# EAGLE board EEZ Arduino shield+BP r1B12b (EAGLE 6.1), part 1 of 2
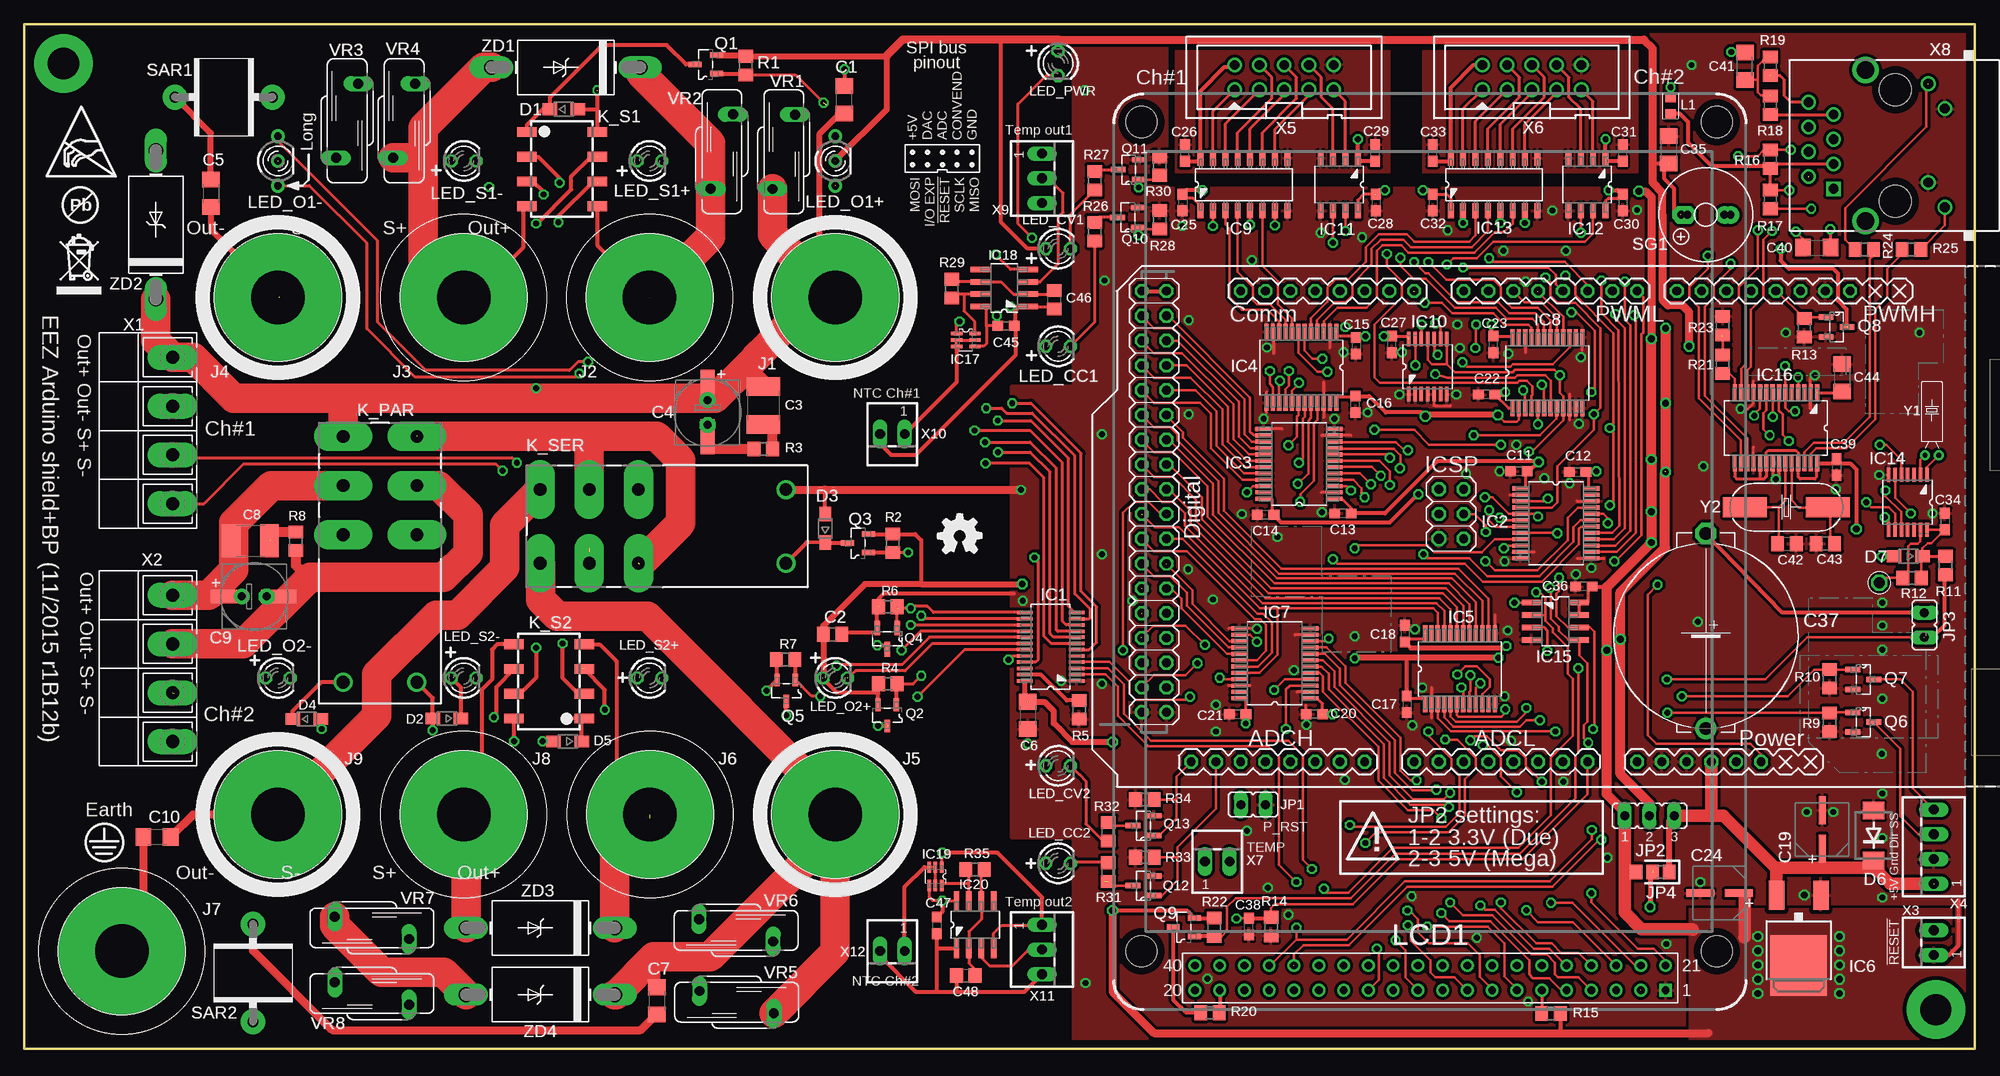
[diagram p5: board, top side]
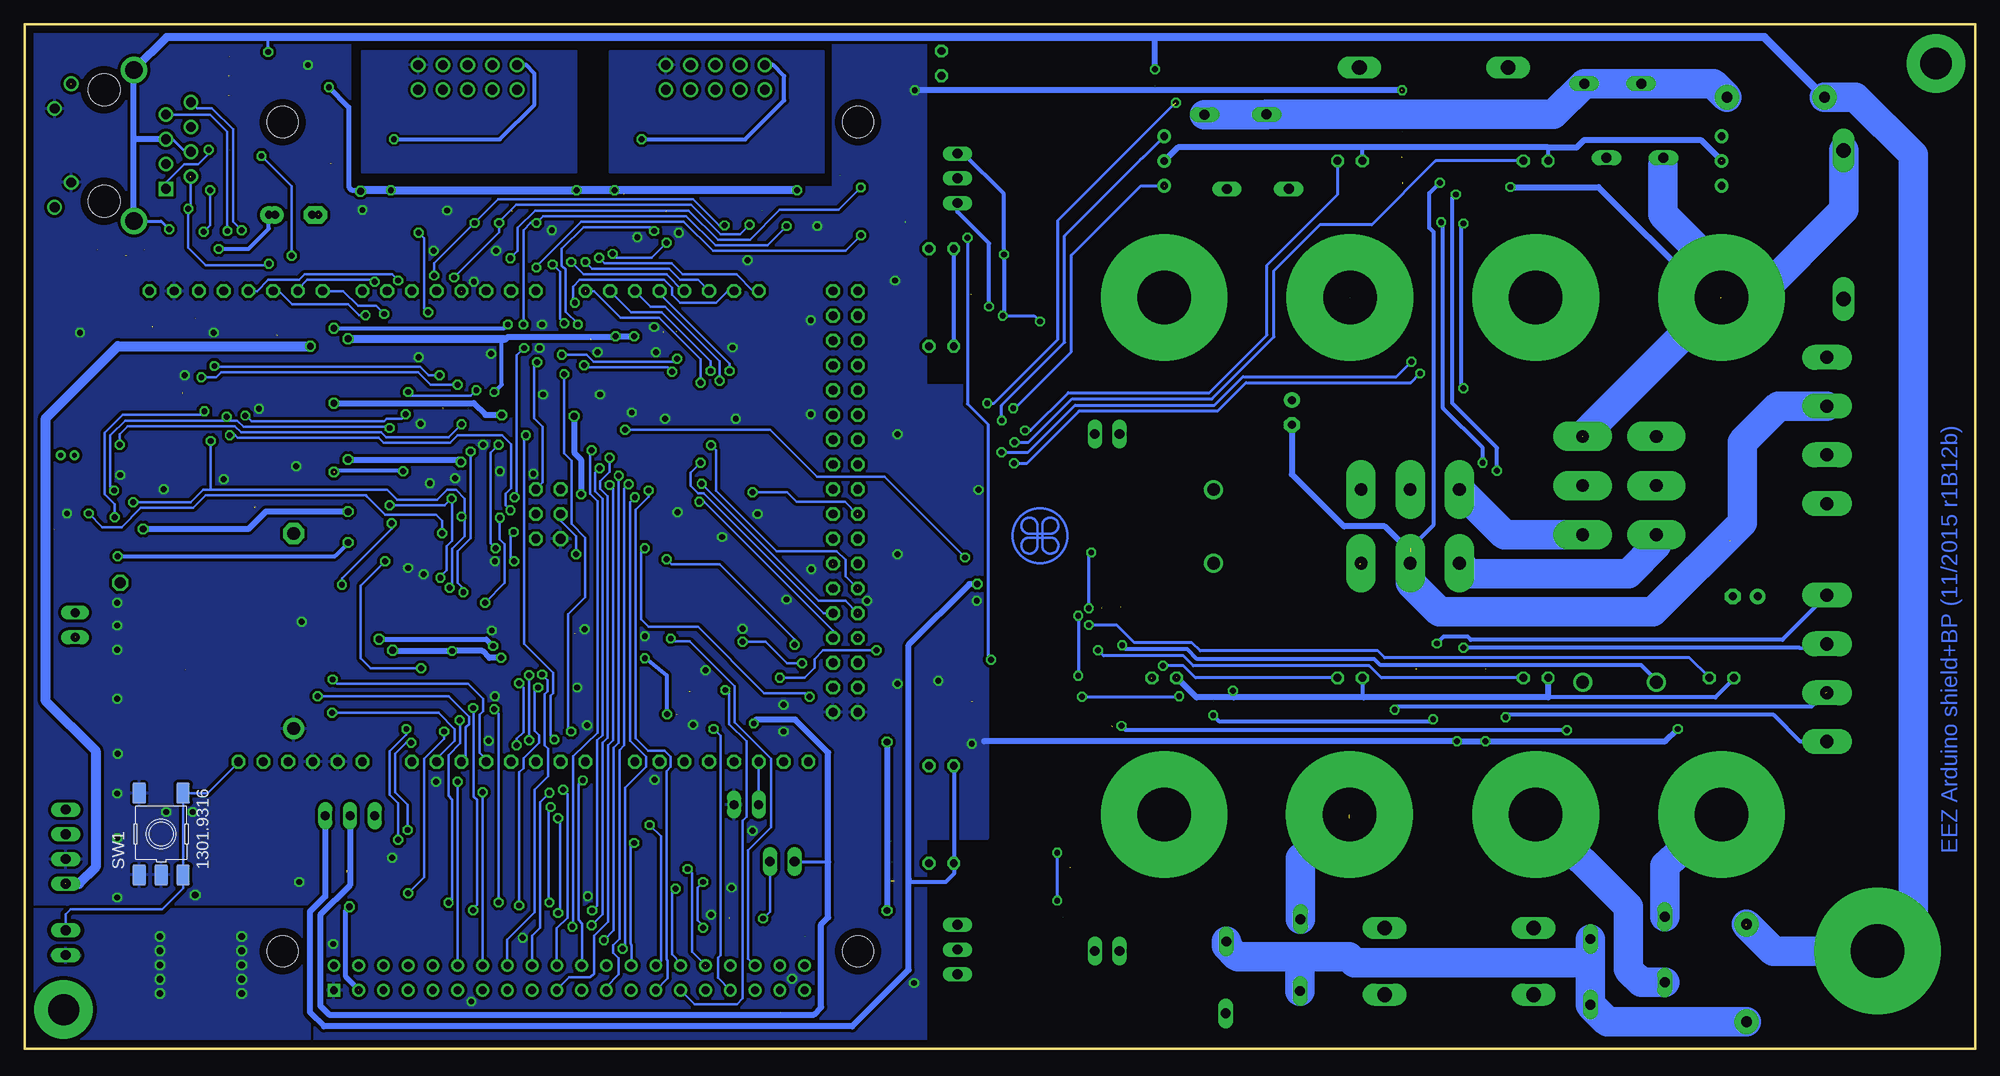
[diagram p6: board, bottom side, seen from below]

Size 200.03 x 105 mm. Coordinates in mm from the lower left corner, seen from the top.
Outline: 0,0 0,105 200,105 200,0 0,0
Copper layers (1+5*16): Top 0.035mm / dielectric 0.75mm / Route5 0.035mm / dielectric 0.75mm / Bottom 0.035mm
Design rules: minimum track width 10mil, minimum drill 0.5mm, track to track 8mil, track to pad 8mil, pad to pad 8mil, via to via 8mil, smd to smd 8mil, copper to edge 30mil, drill to drill 8mil, minimum pad ring 10mil, minimum via ring 8mil, stop-mask expansion 0mil, vias tented up to drill 25mil, thermal gap 10mil
Net classes: 0 default: width 0.254 mm, drill 0.61 mm, clearance 0.254 mm; 1 power: width 0.254 mm, drill 0.406 mm, clearance 0.203 mm; 2 gnd: width 0.254 mm, drill 0.406 mm, clearance 0.203 mm; 3 isolators: width 0.254 mm, drill 0.61 mm, clearance 0.254 mm

## Footprints (pad centres in the part's own frame; a part is rotated, then mirrored left to right if it is on the bottom)
C1206 = smd 1.6 x 1.8: 1 -1.4,0; 2 1.4,0
C0805 = smd 1.3 x 1.5: 1 -0.95,0; 2 0.95,0
C1812 = smd 1.9 x 3.4: 1 -1.95,0; 2 1.95,0
CAPAE660X610N_COMBO2 = smd 3.6 x 1.4: 1 -2.6,0; 2 2.5,0 | drill 0.813 pad 1.6: 1.1 -1.27,0 | drill 0.813 pad 1.6 octagon: 2.1 1.27,0
C0603 = smd 1.1 x 1: 1 -0.85,0; 2 0.85,0
PANASONIC_C = smd 2.87 x 0.762: 1 -1.981,0; 2 1.981,0
SG-R20MM = drill 1.3 pad 2.184 octagon: 1 10.389,0 | drill 1.3 pad 2.184: 2 -9.601,0
SOD323-W = smd 1.5 x 1.2: A 1.45,0; C -1.45,0
DO214AA = smd 1.8 x 2.2: A 2.55,0; C -2.55,0
SOP63P600X175-24N = smd 1.6 x 0.356: 1 -2.667,3.505; 2 -2.667,2.845; 3 -2.667,2.235; 4 -2.667,1.575; 5 -2.667,0.965; 6 -2.667,0.305; 7 -2.667,-0.305; 8 -2.667,-0.965; 9 -2.667,-1.575; 10 -2.667,-2.235; 11 -2.667,-2.845; 12 -2.667,-3.505; 13 2.667,-3.505; 14 2.667,-2.845; 15 2.667,-2.235; 16 2.667,-1.575; 17 2.667,-0.965; 18 2.667,-0.305; 19 2.667,0.305; 20 2.667,0.965; 21 2.667,1.575; 22 2.667,2.235; 23 2.667,2.845; 24 2.667,3.505
SOP65P780X200-24N = smd 1.651 x 0.432: 1 -3.632,3.581; 2 -3.632,2.921; 3 -3.632,2.286; 4 -3.632,1.626; 5 -3.632,0.965; 6 -3.632,0.33; 7 -3.632,-0.33; 8 -3.632,-0.965; 9 -3.632,-1.626; 10 -3.632,-2.286; 11 -3.632,-2.921; 12 -3.632,-3.581; 13 3.632,-3.581; 14 3.632,-2.921; 15 3.632,-2.286; 16 3.632,-1.626; 17 3.632,-0.965; 18 3.632,-0.33; 19 3.632,0.33; 20 3.632,0.965; 21 3.632,1.626; 22 3.632,2.286; 23 3.632,2.921; 24 3.632,3.581
DPACK = smd 1.6 x 3: 1 -2.28,-4.8; 3 2.28,-4.8 | smd 5.8 x 6.2: 4 0,2.38
SOIC-16 = smd 1.549 x 0.61: 1 -2.692,4.445; 2 -2.692,3.175; 3 -2.692,1.905; 4 -2.692,0.635; 5 -2.692,-0.635; 6 -2.692,-1.905; 7 -2.692,-3.175; 8 -2.692,-4.445; 9 2.692,-4.445; 10 2.692,-3.175; 11 2.692,-1.905; 12 2.692,-0.635; 13 2.692,0.635; 14 2.692,1.905; 15 2.692,3.175; 16 2.692,4.445
SOP65P640X120-14N = smd 1.473 x 0.356: 1 -2.819,1.956; 2 -2.819,1.295; 3 -2.819,0.66; 4 -2.819,0; 5 -2.819,-0.66; 6 -2.819,-1.295; 7 -2.819,-1.956; 8 2.819,-1.956; 9 2.819,-1.295; 10 2.819,-0.66; 11 2.819,0; 12 2.819,0.66; 13 2.819,1.295; 14 2.819,1.956
SOIC127P600X173-8N = smd 1.55 x 0.6: 1 -2.7,1.9; 2 -2.7,0.63; 3 -2.7,-0.64; 4 -2.7,-1.91; 5 2.7,-1.91; 6 2.7,-0.64; 7 2.7,0.63; 8 2.7,1.9
SOIC127P600X175-8N = smd 1.981 x 0.559: 1 -2.464,1.905; 2 -2.464,0.635; 3 -2.464,-0.635; 4 -2.464,-1.905; 5 2.464,-1.905; 6 2.464,-0.635; 7 2.464,0.635; 8 2.464,1.905
SOP65P780X200-28N = smd 1.651 x 0.432: 1 -3.632,4.216; 2 -3.632,3.581; 3 -3.632,2.921; 4 -3.632,2.286; 5 -3.632,1.626; 6 -3.632,0.965; 7 -3.632,0.33; 8 -3.632,-0.33; 9 -3.632,-0.965; 10 -3.632,-1.626; 11 -3.632,-2.286; 12 -3.632,-2.921; 13 -3.632,-3.581; 14 -3.632,-4.216; 15 3.632,-4.216; 16 3.632,-3.581; 17 3.632,-2.921; 18 3.632,-2.286; 19 3.632,-1.626; 20 3.632,-0.965; 21 3.632,-0.33; 22 3.632,0.33; 23 3.632,0.965; 24 3.632,1.626; 25 3.632,2.286; 26 3.632,2.921; 27 3.632,3.581; 28 3.632,4.216
SOT65P210X110-6N = smd 1.168 x 0.356: 1 -0.94,0.66; 2 -0.94,0; 3 -0.94,-0.66; 4 0.94,-0.66; 5 0.94,0; 6 0.94,0.66
BP_5_12/15WHITE = drill 5.5 pad 13: P$1 0,0
BP_5_12/15BLK = drill 5.5 pad 13: P$1 0,0
JP1 = drill 0.914 long: 1 0,-1.27; 2 0,1.27
JUMPER_3-PIN = drill 0.914 long: 1 -2.54,0; 2 0,0; 3 2.54,0
A0R-JMP = smd 1.5 x 1.3: 1 0,1.7; 2 0,0; 3 0,-1.7
RT-C/016A5 = drill 1.3 pad 3 long: 11A 8.83,3.78; 11B 8.83,-3.78; 12A 3.79,3.78; 12B 3.79,-3.78; 14A 13.87,3.78; 14B 13.87,-3.78 | drill 1.3: A1 -11.33,-3.78; A2 -11.33,3.78
G6K-2F = smd 1 x 2: 1 -3.81,-3.6; 2 -1.27,-3.6; 3 1.27,-3.6; 4 3.81,-3.6; 5 3.81,3.6; 6 1.27,3.6; 7 -1.27,3.6; 8 -3.81,3.6
BEAD0603 = smd 1 x 1.1: P$1 -0.85,0; P$2 0.85,0
LCD_TFT_320QVT_MIRROR = drill 0.8 square: 1 48.26,0 | drill 0.8: 2 45.72,0; 3 43.18,0; 4 40.64,0; 5 38.1,0; 6 35.56,0; 7 33.02,0; 8 30.48,0; 9 27.94,0; 10 25.4,0; 11 22.86,0; 12 20.32,0; 13 17.78,0; 14 15.24,0; 15 12.7,0; 16 10.16,0; 17 7.62,0; 18 5.08,0; 19 2.54,0; 20 0,0; 21 48.26,2.54; 22 45.72,2.54; 23 43.18,2.54; 24 40.64,2.54; 25 38.1,2.54; 26 35.56,2.54; 27 33.02,2.54; 28 30.48,2.54; 29 27.94,2.54; 30 25.4,2.54; 31 22.86,2.54; 32 20.32,2.54; 33 17.78,2.54; 34 15.24,2.54; 35 12.7,2.54; 36 10.16,2.54; 37 7.62,2.54; 38 5.08,2.54; 39 2.54,2.54; 40 0,2.54 | hole 3.2: -5.5,4; 53.5,4; -5.5,89; 53.5,89
LED3MM = drill 0.813 octagon: A -1.27,0; K 1.27,0
DUO_LED3MM = drill 0.8 pad 1.4: A 2.54,0; AG -2.54,0; C 0,0
ARDUINO+ICSP_MIRROR = drill 0.9 octagon: 0 63.5,2.54; 1 60.96,2.54; 2 58.42,2.54; 3 55.88,2.54; 3.3V 35.56,50.8; 4 53.34,2.54; 5 50.8,2.54; 5V 38.1,50.8; 5V(1) 93.98,2.54; 5V(2) 96.52,2.54; 6 48.26,2.54; 7 45.72,2.54; 8 41.656,2.54; 9 39.116,2.54; 10 36.576,2.54; 11 34.036,2.54; 12 31.496,2.54; 13 28.956,2.54; 14 68.58,2.54; 15 71.12,2.54; 16 73.66,2.54; 17 76.2,2.54; 18 78.74,2.54; 19 81.28,2.54; 20 83.82,2.54; 21 86.36,2.54; 22 93.98,5.08; 23 96.52,5.08; 24 93.98,7.62; 25 96.52,7.62; 26 93.98,10.16; 27 96.52,10.16; 28 93.98,12.7; 29 96.52,12.7; 30 93.98,15.24; 31 96.52,15.24; 32 93.98,17.78; 33 96.52,17.78; 34 93.98,20.32; 35 96.52,20.32; 36 93.98,22.86; 37 96.52,22.86; 38 93.98,25.4; 39 96.52,25.4; 40 93.98,27.94; 41 96.52,27.94; 42 93.98,30.48; 43 96.52,30.48; 44 93.98,33.02; 45 96.52,33.02; 46 93.98,35.56; 47 96.52,35.56; 48 93.98,38.1; 49 96.52,38.1; 50 93.98,40.64; 51 96.52,40.64; 52 93.98,43.18; 53 96.52,43.18; A0 50.8,50.8; A1 53.34,50.8; A2 55.88,50.8; A3 58.42,50.8; A4 60.96,50.8; A5 63.5,50.8; A6 66.04,50.8; A7 68.58,50.8; A8 73.66,50.8; A9 76.2,50.8; A10 78.74,50.8; A11 81.28,50.8; A12 83.82,50.8; A13 86.36,50.8; A14 88.9,50.8; A15 91.44,50.8; AREF 23.876,2.54; GND 26.416,2.54; GND1 40.64,50.8; GND2 43.18,50.8; GND3 93.98,45.72; GND4 96.52,45.72; ICSP_+5V 66.04,22.86; ICSP_MISO 63.5,22.86; ICSP_MOSI 66.04,25.4; ICSP_RESET 63.5,27.94; ICSP_SCK 63.5,25.4; RESET 33.02,50.8; VIN 45.72,50.8 | drill 1.016 octagon: ICSP_GND 66.04,27.94
SOT95P237X112-3N = smd 1.321 x 0.559: 1 -1.092,0.94; 2 -1.092,-0.94; 3 1.092,0
SOT103P240X110-3N = smd 1.524 x 0.559: 1 -1.079,1.016; 2 -1.079,-1.016; 3 1.079,0
R0805 = smd 1.3 x 1.5: 1 -0.95,0; 2 0.95,0
SAR = drill 1.1 pad 2.54: P$1 0,0; P$2 10,0
BUZZER = drill 0.8 pad 1.778 octagon: + 1.905,0; +B 2.54,0 | drill 0.8 pad 1.778: - -1.905,0; -B -2.54,0
TACTM-6XN = smd 2.1 x 1.4: 1 -4.2,2.25; 2 4.2,2.25; 3 -4.2,-2.25; 4 4.2,-2.25; 5 -4.2,0
PCB_SHIELD_TAB = drill 1.1 octagon: 1 0,0
S10K175 = drill 1.016 long: 1 -1.143,-3.81; 2 1.143,3.81
TBLOCK5.0_4S = drill 1.35 pad 2.54 long: P$1 0,0; P$2 0,-5; P$3 0,-10; P$4 0,-15
22-23-2021 = drill 1 long: 1 -1.27,0; 2 1.27,0
22-23-2041 = drill 1 long: 1 -3.81,0; 2 -1.27,0; 3 1.27,0; 4 3.81,0
IDC-10PIN = drill 1 pad 1.422: 1 -5.08,-1.27; 2 -5.08,1.27; 3 -2.54,-1.27; 4 -2.54,1.27; 5 0,-1.27; 6 0,1.27; 7 2.54,-1.27; 8 2.54,1.27; 9 5.08,-1.27; 10 5.08,1.27
RJ45-TRAFO-LED = drill 1 square: 1 -4.445,6.35 | drill 1: 2 -3.175,8.89; 3 -1.905,6.35; 4 -0.635,8.89; 5 0.635,6.35; 6 1.905,8.89; 7 3.175,6.35; 8 4.445,8.89; 9 -6.325,-5.08; 10 -3.785,-3.38; 11 3.785,-5.08; 12 6.325,-3.38 | drill 1.8: SH1 -7.75,3.05; SH2 7.75,3.05 | hole 3.251: -5.715,0; 5.715,0
22-23-2031 = drill 1 long: 1 -2.54,0; 2 0,0; 3 2.54,0
R26_XTAL = drill 0.5: 1 -0.7,0; 2 0.7,0
HC-49/4H = smd 4.5 x 2: 1 -4.25,0; 2 4.25,0
DO201 = drill 1.499 long: A 7.62,0; C -7.62,0

## Placement (x,y rotation side)
C1  10n  [C1206]  84.08,97.28 90 top
C2  1u  [C0805]  82.88,42.48 0 top
C3  470n/100V  [C1812]  75.77,65.91 270 top
C4  22u/63V  [CAPAE660X610N_COMBO2]  70.06,65.21 270 top
C5  10n  [C1206]  19.13,87.69 270 top
C6  10u  [C1206]  102.89,34.16 270 top
C7  10n  [C1206]  64.85,4.89 270 top
C8  470n/100V  [C1812]  23.19,52.07 0 top
C9  22u/63V  [CAPAE660X610N_COMBO2]  23.57,46.35 0 top
C10  10n  [C1206]  13.61,21.72 0 top
C11  100n  [C0603]  153.24,59.18 180 top
C12  100n  [C0603]  159.27,59.12 0 top
C13  100n  [C0603]  135.21,54.86 180 top
C14  100n  [C0603]  127.27,54.74 0 top
C15  100n  [C0603]  136.54,72.06 270 top
C16  100n  [C0603]  136.48,66.05 90 top
C17  100n  [C0603]  141.75,35.31 270 top
C18  100n  [C0603]  141.56,42.55 270 top
C19  47u  [PANASONIC_C]  184.36,22.48 90 top
C20  100n  [C0603]  132.29,34.29 180 top
C21  100n  [C0603]  124.41,34.29 0 top
C22  100n  [C0603]  149.94,67.06 180 top
C23  100n  [C0603]  150.64,72.2 90 top
C24  10u  [PANASONIC_C]  173.82,15.94 180 top
C25  100n  [C0603]  118.76,86.74 270 top
C26  100n  [C0603]  119.02,91.82 90 top
C27  100n  [C0603]  140.22,72.2 90 top
C28  100n  [C0603]  138.57,86.74 270 top
C29  100n  [C0603]  138.51,91.82 90 top
C30  100n  [C0603]  163.91,86.74 270 top
C31  100n  [C0603]  163.91,91.82 90 top
C32  100n  [C0603]  144.41,86.74 270 top
C33  100n  [C0603]  144.41,91.82 90 top
C34  100n  [C0603]  196.93,54.04 270 top
C35  10u  [C1206]  168.61,92.14 270 top
C36  100n  [C0603]  159.91,47.37 180 top
C37  EECS5R5H105  [SG-R20MM]  172.42,42.42 90 top
C38  100n  [C0603]  125.56,12.51 90 top
C39  100n  [C0603]  185.82,59.63 270 top
C40  10n  [C1206]  183.78,82.11 0 top
C41  10n  [C1206]  176.42,100.71 90 top
C42  18p  [C0805]  180.74,51.75 0 top
C43  18p  [C0805]  184.67,51.75 180 top
C44  10u  [C1206]  186.39,68.77 270 top
C45  100n  [C0603]  100.66,74.1 0 top
C46  47n  [C0805]  105.62,76.77 90 top
C47  100n  [C0603]  93.55,12.64 270 top
C48  47n  [C0805]  96.54,7.49 0 top
D1  BAS316  [SOD323-W]  55.32,96.3 0 top
D2  BAS316  [SOD323-W]  43.32,33.85 180 top
D3  BAS316  [SOD323-W]  82.12,53.34 90 top
D4  BAS316  [SOD323-W]  28.97,33.78 0 top
D5  BAS316  [SOD323-W]  55.71,31.5 180 top
D6  SMBJ5.0A-TR  [DO214AA]  189.63,21.84 90 top
D7  BAS316  [SOD323-W]  193.18,50.48 180 top
EEZ_SIGNATURE  SIGNATURESMALL  [SIGNATURE_5MM]  95.9,52.59 180 top
IC1  TLC5925  [SOP63P600X175-24N]  105.23,41.21 180 top
IC2  SN74LVCC3245ADBRSSOP  [SOP65P780X200-24N]  157.05,53.85 0 top
IC3  SN74LVCC3245ADBRSSOP  [SOP65P780X200-24N]  130.7,59.94 180 top
IC4  SN74LVCC3245ADBRSSOP  [SOP65P780X200-24N]  130.95,69.85 270 top
IC5  SN74LVCC3245ADBRSSOP  [SOP65P780X200-24N]  147.21,38.93 90 top
IC6  LD1117ADT33TR  [DPACK]  181.94,10.92 180 top
IC7  SN74LVCC3245ADBRSSOP  [SOP65P780X200-24N]  128.22,39.5 180 top
IC8  SN74LVCC3245ADBRSSOP  [SOP65P780X200-24N]  156.16,69.28 90 top
IC9  Si8660EC-B-IS1  [SOIC-16]  125.05,88.58 90 top
IC10  SN74LV125APW  [SOP65P640X120-14N]  143.91,69.91 90 top
IC11  SI8620EC-B-IS  [SOIC127P600X173-8N]  134.83,88.58 270 top
IC12  SI8620EC-B-IS  [SOIC127P600X173-8N]  160.23,88.58 270 top
IC13  Si8660EC-B-IS1  [SOIC-16]  150.7,88.58 90 top
IC14  PCA21125  [SOP65P640X120-14N]  193.12,56.01 270 top
IC15  AT25256B  [SOIC127P600X175-8N]  156.99,43.81 0 top
IC16  ENC28J60-I/SS  [SOP65P780X200-28N]  179.59,63.63 270 top
IC17  BC857BS  [SOT65P210X110-6N]  96.54,72.64 0 top
IC18  NE555D  [SOIC127P600X175-8N]  100.47,77.98 180 top
IC19  BC857BS  [SOT65P210X110-6N]  93.42,17.65 270 top
IC20  NE555D  [SOIC127P600X175-8N]  97.49,12.7 90 top
J1  BS-244DSM-R  [BP_5_12/15WHITE]  83.15,77 0 top
J2  BS-244DSM-Y  [BP_5_12/15BLK]  64.1,77 0 top
J3  BS-244DSM-BL  [BP_5_12/15BLK]  45.05,77 0 top
J4  BS-244DSM-B  [BP_5_12/15WHITE]  26,77 0 top
J5  BS-244DSM-R  [BP_5_12/15WHITE]  83.15,24 0 top
J6  BS-244DSM-Y  [BP_5_12/15BLK]  64.15,24 0 top
J7  BS-244DSM-G  [BP_5_12/15BLK]  10,10 0 top
J8  BS-244DSM-BL  [BP_5_12/15BLK]  45.05,24 0 top
J9  BS-244DSM-B  [BP_5_12/15WHITE]  26,24 0 top
JP1  826926-2  [JP1]  126,25.02 270 top
JP2  826926-3  [JUMPER_3-PIN]  166.64,23.88 0 top
JP3  826926-2  [JP1]  194.83,43.43 0 top
JP4  0R-JUMPA  [A0R-JMP]  166.96,18.1 270 top
K_PAR  RT424005  [RT-C/016A5]  36.47,48.9 90 top
K_S1  G6K-2F-5DC  [G6K-2F]  55.13,90.17 270 top
K_S2  G6K-2F-5DC  [G6K-2F]  53.8,37.66 90 top
K_SER  RT424005  [RT-C/016A5]  66.75,53.53 180 top
L1  60R@100MHz  [BEAD0603]  168.8,96.65 90 top
LCD1  TFT_320QVT  [LCD_TFT_320QVT_MIRROR]  120.03,5.99 0 top
LED_CC1  L-934ID  [LED3MM]  106,72 0 top
LED_CC2  L-934ID  [LED3MM]  106,19 0 top
LED_CV1  L-934YD  [LED3MM]  106,82 0 top
LED_CV2  L-934YD  [LED3MM]  106,29 0 top
LED_O1+  L-115WEGW-CA  [DUO_LED3MM]  83.15,91 270 top
LED_O1-  L-115WEGW-CA  [DUO_LED3MM]  26,91 270 top
LED_O2+  L-934GD  [LED3MM]  83.15,38 0 top
LED_O2-  L-934GD  [LED3MM]  26,38 0 top
LED_PWR  L-934MBC  [LED3MM]  106,101 270 top
LED_S1+  L-934YD  [LED3MM]  64.1,91 0 top
LED_S1-  L-934YD  [LED3MM]  45.05,91 0 top
LED_S2+  L-934YD  [LED3MM]  64.1,38 0 top
LED_S2-  L-934YD  [LED3MM]  45.05,38 0 top
MCU  [ARDUINO+ICSP_MIRROR]  211.09,80.2 180 top
Q1  IRLML2246TRPBF  [SOT95P237X112-3N]  69.87,100.9 180 top
Q2  IRLML2246TRPBF  [SOT95P237X112-3N]  88.47,34.16 270 top
Q3  IRLML2246TRPBF  [SOT95P237X112-3N]  85.49,51.82 180 top
Q4  2N7002  [SOT103P240X110-3N]  88.47,42.04 270 top
Q5  IRLML2246TRPBF  [SOT95P237X112-3N]  78.12,36.7 270 top
Q6  2N7002  [SOT103P240X110-3N]  188.55,33.46 0 top
Q7  2N7002  [SOT103P240X110-3N]  188.55,37.85 0 top
Q8  2N7002  [SOT103P240X110-3N]  185.82,73.98 0 top
Q9  IRLML2246TRPBF  [SOT95P237X112-3N]  118.89,12.45 180 top
Q10  2N7002  [SOT103P240X110-3N]  113.17,85.22 180 top
Q11  2N7002  [SOT103P240X110-3N]  113.24,90.11 180 top
Q12  2N7002  [SOT103P240X110-3N]  114.76,16.7 180 top
Q13  2N7002  [SOT103P240X110-3N]  114.76,22.86 180 top
R1  4K7  [R0805]  73.99,100.77 90 top
R2  4K7  [R0805]  89.04,51.82 90 top
R3  1R  [R0805]  75.77,61.47 0 top
R4  100K  [R0805]  88.53,37.4 180 top
R5  1K5  [R0805]  108.16,34.74 90 top
R6  100K  [R0805]  88.53,45.3 0 top
R7  4K7  [R0805]  78.06,39.88 180 top
R8  1R  [R0805]  27.83,52.01 90 top
R9  100K  [R0805]  185.12,33.46 270 top
R10  100K  [R0805]  185.12,37.91 270 top
R11  560R  [R0805]  196.99,49.53 90 top
R12  10K  [R0805]  193.56,48.26 180 top
R13  100K  [R0805]  182.51,73.91 90 top
R14  4K7  [R0805]  127.84,12.51 270 top
R15  10K  [R0805]  156.54,3.62 0 top
R16  50R 0.1%  [R0805]  179.02,91.19 90 top
R17  50R 0.1%  [R0805]  179.02,87.06 90 top
R18  50R 0.1%  [R0805]  179.02,96.71 270 top
R19  50R 0.1%  [R0805]  179.02,100.71 90 top
R20  10R  [R0805]  121.56,3.68 0 top
R21  2K2 1%  [R0805]  174.13,70.17 90 top
R22  100K  [R0805]  122,12.45 90 top
R23  120R 1%  [R0805]  174.13,74.1 90 top
R24  200R  [R0805]  188.67,81.92 180 top
R25  200R  [R0805]  193.5,81.92 0 top
R26  240R  [R0805]  109.74,83.76 90 top
R27  240R  [R0805]  109.74,88.96 270 top
R28  100K  [R0805]  116.41,84.96 90 top
R29  1K5  [R0805]  95.08,77.91 90 top
R30  100K  [R0805]  116.41,90.49 90 top
R31  240R  [R0805]  111.14,18.1 270 top
R32  240R  [R0805]  111.14,22.23 270 top
R33  100K  [R0805]  114.89,19.62 180 top
R34  100K  [R0805]  114.89,25.53 180 top
R35  1K5  [R0805]  97.49,18.35 0 top
SAR1  2057-09-BLF  [SAR]  15.44,97.54 0 top
SAR2  2057-09-BLF  [SAR]  23.45,12.76 270 top
SG1  LD-BZEN-0903  [BUZZER]  172.42,85.47 180 top
SW1  1301.9316  [TACTM-6XN]  186,22 90 bottom
TP1  [PCB_SHIELD_TAB]  190.2,47.75 0 top
U$2  [RECYCLE_BIN1/8]  3.32,77.34 0 top
U$3  [PB_SMALL]  5.74,86.49 0 top
U$4  [ESD_SYMBOL]  2.27,89.45 0 top
VR1  ERZE08A201  [S10K175]  77.87,91.94 180 top
VR2  ERZE08A201  [S10K175]  71.52,91.96 180 top
VR3  ERZE08A201  [S10K175]  33.1,95.12 0 top
VR4  ERZE08A201  [S10K175]  38.94,95.12 0 top
VR5  ERZE08A201  [S10K175]  73.04,4.76 270 top
VR6  ERZE08A201  [S10K175]  72.97,12.13 90 top
VR7  ERZE08A201  [S10K175]  35.64,12.38 270 top
VR8  ERZE08A201  [S10K175]  35.64,5.65 270 top
X1  282836-4  [TBLOCK5.0_4S]  15.19,70.87 0 top
X2  282836-4  [TBLOCK5.0_4S]  15.19,46.48 0 top
X3  22-23-2021  [22-23-2021]  195.79,10.86 90 top
X4  22-23-2041  [22-23-2041]  195.78,20.7 90 top
X5  09185106324  [IDC-10PIN]  129.18,99.57 0 top
X6  09185106324  [IDC-10PIN]  154.57,99.57 0 top
X7  22-23-2021  [22-23-2021]  122.32,19.18 0 top
X8  LMJTAB881243M-L  [RJ45-TRAFO-LED]  191.85,92.58 90 top
X9  22-23-2031  [22-23-2031]  104.35,89.22 270 top
X10  22-23-2021  [22-23-2021]  89,63 180 top
X11  22-23-2031  [22-23-2031]  104.35,10.16 270 top
X12  22-23-2021  [22-23-2021]  89,10 180 top
Y1  32,768kHz  [R26_XTAL]  195.6,60.83 0 top
Y2  25MHz  [HC-49/4H]  180.67,55.5 180 top
ZD1  1.5KE68A  [DO201]  55.51,100.58 180 top
ZD2  1.5KE68A  [DO201]  13.48,84.46 90 top
ZD3  1.5KE68A  [DO201]  52.91,12.38 180 top
ZD4  1.5KE68A  [DO201]  52.91,5.52 180 top

## Tracks (layer width: path | path; a pad name or v marks a point on that pad's centre or on a via)
3V3BP_SELECT  (via drill 0.6)
  Top 0.254: v119.52,36.07 119.21,35.75 113.94,35.75 113.3,36.39 113.3,37.59 111.26,39.64 IC1.4 | IC2.9 150.79,52.22 149.43,50.86 144.61,50.86 143.84,51.63 136.73,51.63 v136.41,51.31
  Bottom 0.254: v119.52,36.07 119.9,36.45 124.16,36.45 130.95,43.24 136.03,43.24 136.79,44.01 136.79,50.86 v136.41,51.31
3V3LCD_CS  (via drill 0.6)
  Top 0.254: IC7.4 129.26,37.87 v128.16,36.77
  Bottom 0.254: LCD1.15 131.32,4.57 126.95,4.57 126.38,5.14 126.38,23.37 126,23.75 126,31.5 127.78,33.27 127.78,36.39 v128.16,36.77
3V3LCD_DB0  (via drill 0.6)
  Top 0.254: LCD1.21 168.29,9.02 167.08,10.22 165.43,10.22 160.67,14.99 v160.67,15.94 | v156.99,32.51 146.26,32.51 144.92,33.85 IC5.3
  Bottom 0.254: v160.67,15.94 159.02,17.59 159.02,29.72 156.99,31.75 v156.99,32.51
3V3LCD_DB1  (via drill 0.6)
  Top 0.254: v156.54,14.94 158.75,14.94 165.18,8.51 165.73,8.51 LCD1.22 | IC5.4 145.58,33.95 146.51,33.02 153.37,33.02 154,33.66 v155.4,33.66
  Bottom 0.254: v156.54,14.94 156.16,15.32 156.16,25.53 156.54,25.91 156.54,30.1 155.34,31.3 155.34,33.59 v155.4,33.66
3V3LCD_DB2  (via drill 0.6)  (1 unrouted)
  Top 0.254: LCD1.23 158.78,12.95 155.21,12.95 154,14.16 | IC5.5 146.24,34.05 146.76,33.53 153.05,33.53 154,34.48 v154,34.92
  Bottom 0.254: v154,14.18 154,14.35 153.62,14.73 153.62,25.53 153.94,25.84 153.94,34.86 v154,34.92
3V3LCD_DB3  (via drill 0.6)
  Top 0.254: LCD1.24 160.65,8.53 159.4,9.78 157.62,9.78 156.61,10.79 155.02,10.79 151.4,14.41 v151.4,14.99 | IC5.6 146.89,35.28 146.89,34.16 147.02,34.04 151.46,34.04 151.84,34.42 v151.84,34.8
  Bottom 0.254: v151.4,14.99 151.4,34.35 v151.84,34.8
3V3LCD_DB4  (via drill 0.6)
  Top 0.254: 158.11,8.53 LCD1.25 158.05,8.53 156.35,10.22 154.77,10.22 150.76,14.22 149.75,14.22 v149.3,14.67 | IC5.7 147.54,36.82 v147.34,37.02
  Bottom 0.254: v149.3,14.67 149.3,28.32 148.86,28.77 148.86,29.78 147.27,31.37 147.27,32.13 147.72,32.58 147.72,36.64 v147.34,37.02
3V3LCD_DB5  (via drill 0.6)
  Top 0.254: v155.59,27.37 153.94,29.02 153.94,29.78 153.11,30.61 151.4,30.61 151.21,30.8 149.94,32 148.67,32 v148.29,31.62 | v148.29,38.29 148.29,36.64 148.17,36.52 IC5.8
  Bottom 0.254: LCD1.26 v155.59,27.37 | v148.29,31.62 v148.29,38.29
3V3LCD_DB6  (via drill 0.6)
  Top 0.254: v153.05,26.29 151.4,27.94 151.4,29.78 150.07,31.11 v149.56,31.11 | IC5.9 148.84,36.99 v149.3,37.47
  Bottom 0.254: LCD1.27 v153.05,26.29 | v149.56,31.11 149.56,31.75 148.86,32.45 148.86,37.02 v149.3,37.47
3V3LCD_DB7  (via drill 0.6)
  Top 0.254: IC5.10 149.5,36.32 150.26,37.08 150.26,37.85 148.92,39.18 147.78,39.18 v146.96,38.35
  Bottom 0.254: LCD1.28 150.51,11.18 147.72,13.97 147.72,26.54 146.32,27.94 146.32,30.73 146.7,31.11 146.7,36.32 146.38,36.64 146.38,37.78 v146.96,38.35
3V3LCD_DB8  (via drill 0.6)
  Top 0.254: LCD1.7 153.05,6.16 151.78,7.43 151.78,10.79 150.07,12.51 v143.84,12.51 | v141.88,61.34 141.49,61.34 140.66,62.18 134.71,62.18 IC3.10
  Bottom 0.254: v143.84,12.51 143.78,12.57 143.78,29.97 141.24,32.38 141.24,56.13 142,56.9 142,61.21 v141.88,61.34
3V3LCD_DB9  (via drill 0.6)
  Top 0.254: LCD1.8 150.51,6.1 149.24,7.37 149.24,9.59 148.03,10.79 144.03,10.79 142.89,11.94 142.89,13.27 142,14.16 v141.81,14.16 | IC3.9 134.71,61.52 140.43,61.52 141.11,60.83 141.11,59.56 v141.05,59.5
  Bottom 0.254: v141.81,14.16 141.3,14.67 141.3,31.62 140.73,32.13 140.73,56.39 141.49,57.15 141.49,59.05 v141.05,59.5
3V3LCD_DB10  (via drill 0.6)  (1 unrouted)
  Top 0.254: v140.03,60.58 139.7,60.91 IC3.8 | 147.97,5.97 146.64,7.3 144.67,7.3 144.16,7.81 144.16,9.08 142.19,11.05 142.19,12.32 v141.88,12.64
  Bottom 0.254: v140.03,60.58 140.03,59.12 140.99,58.17 140.99,57.4 140.22,56.64 140.22,31.88 140.73,31.37 140.73,13.78 v141.88,12.64
3V3LCD_DB11  (via drill 0.6)
  Top 0.254: IC3.7 134.71,60.25 138.97,60.25 140.03,59.18 v140.03,57.78
  Bottom 0.254: LCD1.10 145.43,6.03 144.16,7.3 142,7.3 141.62,7.68 141.62,11.56 140.16,13.02 140.16,31.11 139.65,31.62 139.65,57.4 v140.03,57.78
3V3LCD_DB12  (via drill 0.6)
  Top 0.254: LCD1.11 142.89,6.03 141.62,7.3 141.62,10.1 v140.6,11.11 | v139.08,58.74 138.18,59.64 134.71,59.64 IC3.6
  Bottom 0.254: v139.08,58.74 139.08,31.37 139.59,30.86 139.59,12.13 v140.6,11.11
3V3LCD_DB13  (via drill 0.6)
  Top 0.254: v138.06,57.85 136.94,58.98 IC3.5
  Bottom 0.254: LCD1.12 140.35,6.35 139.08,7.62 139.08,9.27 139.65,9.84 139.65,10.6 139.02,11.24 139.02,30.61 138.51,31.11 138.51,57.4 v138.06,57.85
3V3LCD_DB14  (via drill 0.6)  (1 unrouted)
  Top 0.254: v137.43,56.52 137.11,56.83 137.11,57.47 136.26,58.32 IC3.4 | v138.7,10.22 138.89,10.03 138.89,7.05 137.81,5.97
  Bottom 0.254: v137.43,56.52 137.94,56.01 137.94,31.56 136.29,29.91 136.29,28.89 138.45,26.73 138.45,10.48 v138.7,10.22
3V3LCD_DB15  (via drill 0.6)
  Top 0.254: IC3.3 135.59,57.66 v136.03,57.21
  Bottom 0.254: v136.03,57.21 136.03,56.58 137.37,55.24 137.37,31.81 136.1,30.54 134.38,30.54 133.75,29.91 133.75,28.89 134.19,28.45 134.19,9.14 134.06,9.02 134.06,7.19 LCD1.14
3V3LCD_RD
  Top 0.305: LCD1.6 155.59,3.81 R15.1
3V3LCD_RESET  (via drill 0.6)
  Top 0.254: IC7.3 129.75,37.21 129.37,36.83 v129.37,32.77
  Bottom 0.254: LCD1.17 128.92,7.26 128.92,9.34 128.67,9.59 128.67,32.07 v129.37,32.77
3V3LCD_RS  (via drill 0.6)
  Top 0.254: LCD1.4 160.65,5.99 159.34,7.3 157.24,7.3 156.92,7.62 156.92,8.83 156.1,9.65 154.51,9.65 150.51,13.65 147.53,13.65 v146.19,14.99 | v146.07,24.77 145.81,25.02 142.13,25.02 139.4,27.75 139.4,31.18 133.75,36.83 133.75,38.42 133,39.17 IC7.6
  Bottom 0.254: v146.07,24.77 146.26,24.57 146.26,15.05 v146.19,14.99
3V3LCD_WR  (via drill 0.6)
  Top 0.254: LCD1.5 157.61,5.99 156.35,7.24 154.7,7.24 154.32,7.62 154.32,9.08 150.32,13.08 146.13,13.08 v145.3,13.91 | v145.3,23.62 144.48,24.45 141.88,24.45 138.83,27.5 138.83,30.92 133.18,36.58 133.18,38.16 132.81,38.53 IC7.5
  Bottom 0.254: v145.3,13.91 145.11,14.1 145.11,23.43 v145.3,23.62
3V3LCDSD_CS  (via drill 0.6)
  Top 0.254: IC7.10 133.49,41.78 v133.75,42.04
  Bottom 0.254: LCD1.38 125.81,9.22 125.81,20.32 123.46,22.67 123.46,29.72 127.21,33.47 127.21,37.15 IC7.10 133.49,41.78 v133.75,42.04
3V3MISO  (via drill 0.6)
  Top 0.254: 180.55,67.25 v180.55,69.98 | IC16.6 180.55,67.25 | IC14.8 191.16,53.77 | 191.16,53.77 191.15,53.78 | 191.16,53.77 191.16,54.09 v190.77,54.48 | 180.55,67.25 180.55,65.72 180.93,65.34 v181.56,65.34 | 145.81,70.17 145.88,70.17 146.7,69.34 152.61,69.34 152.86,69.6 156.86,69.6 v157.43,69.03 157.43,67.25 157.79,66.89 IC8.9 157.79,64.43 154.57,61.21 v154.26,61.21 | 145.81,70.17 144.35,70.17 143.91,70.61 IC10.11 | IC10.8 145.86,70.22 145.81,70.17 | v133.24,16.38 133.62,16 135.78,16 140.35,20.57 153.18,20.57 156.54,23.94 156.54,29.84 158.77,32.07 158.77,37.91 158.26,38.42 158.26,41.15 156.73,42.67 156.73,43.12 155.97,43.88 155.97,44.39 | 155.97,44.39 155.97,46.23 155.4,46.8 v155.02,46.8 | IC15.2 155.91,44.45 155.97,44.39
  Bottom 0.254: v181.56,65.34 181.94,64.96 189.94,64.96 191.79,63.12 191.79,56.83 190.77,55.82 v190.77,54.48 | v180.55,69.98 180.48,69.91 159.46,69.91 158.58,69.03 v157.43,69.03 | LCD1.35 132.73,8.76 133.62,9.65 133.62,16 v133.24,16.38 | v154.26,61.21 154.26,52.32 155.59,50.99 155.59,47.75 155.02,47.18 v155.02,46.8
3V3MOSI  (via drill 0.6)
  Top 0.254: IC1.2 110.88,38.37 112.16,37.08 112.16,34.1 115.27,30.99 127.59,30.99 128.67,29.91 128.67,18.86 v130.44,17.08 | LCD1.37 127.8,8.53 130.44,11.18 | 130.44,11.18 135.59,11.18 141.56,17.14 156.42,17.14 160.73,21.46 v160.73,22.42 | v160.35,31.37 159.91,31.81 159.91,33.15 160.29,33.53 160.29,39.5 159.45,40.34 IC15.5 158.32,41.91 157.37,42.86 157.37,43.24 156.54,44.07 156.54,47.12 v156.42,47.24 | IC16.7 179.91,67.25 179.91,65.41 180.29,65.02 180.29,62.93 v180.93,62.29 | IC9.2 v121.87,84.33 | v147.53,84.64 IC13.2 | 130.44,11.18 v130.44,12.38 | IC14.9 191.82,54.83 191.15,55.5 189.37,55.5 v188.87,56.01 | v148.86,74.23 148.86,71.88 v148.8,71.82 | v149.75,56.52 150.51,56.52 152.21,54.81 IC2.5 154.94,54.81 v155.21,54.55
  Bottom 0.254: v160.35,31.37 160.86,31.37 162,30.23 162,26.29 160.73,25.02 v160.73,22.42 | v148.86,74.23 148.86,83.88 148.1,84.64 v147.53,84.64 146.83,85.34 132.16,85.34 129.18,82.36 123.84,82.36 v121.87,84.33 | v130.44,12.38 130.44,12.57 131.02,13.14 131.02,16.51 v130.44,17.08 | v188.87,56.01 182.96,56.01 181.69,57.28 180.93,57.28 | v180.93,62.29 180.93,57.28 | v156.42,47.24 156.35,47.24 156.16,47.43 156.16,51.24 154.89,52.51 154.89,54.55 | v148.8,71.82 149.56,71.06 149.56,56.71 v149.75,56.52 | 154.89,54.55 154.89,56.39 155.78,57.28 156.67,57.28 157.69,56.26 161.81,56.26 162.83,57.28 180.93,57.28 | v155.21,54.55 154.89,54.55
3V3RTC_SELECT  (via drill 0.6)
  Top 0.254: IC14.6 191.82,56.48 v193.44,54.86 | IC2.8 157.13,52.88 v157.18,52.83
  Bottom 0.254: v193.44,54.86 192.04,53.47 190.07,53.47 188.1,55.44 182.71,55.44 181.44,56.71 164.99,56.71 164.93,56.64 164.86,56.58 163.02,54.74 157.81,54.74 157.18,54.1 v157.18,52.83
3V3SCLK  (via drill 0.6)  (1 unrouted)
  Top 0.254: IC1.3 111.09,38.98 112.73,37.34 112.73,34.35 115.52,31.56 129.62,31.56 131.08,30.1 131.08,19.37 v132.03,18.41 | LCD1.36 130.21,8.53 | 130.19,8.51 130.19,9.65 131.14,10.6 135.84,10.6 141.81,16.57 156.67,16.57 161.5,21.4 v161.69,21.4 | v160.86,32.77 160.86,32.83 160.99,32.96 160.99,42.74 160.54,43.18 159.53,43.18 | 159.53,43.18 159.46,43.12 | 159.53,43.18 IC15.6 158.26,43.18 157.12,44.32 157.12,46.61 157.37,46.86 v157.37,48.26 | IC16.8 179.26,65.23 v179.28,64.77 | IC9.7 v128.22,84.39 | IC13.7 v153.88,84.64 | v158,79.25 159.02,78.23 159.02,77.28 162.96,73.34 162.96,63.63 | IC14.10 192.46,55.02 190.83,56.64 v190.83,57.21 | 162.96,63.63 162.96,56.01 v162.58,55.69 | v162.58,63.63 162.96,63.63 | IC2.3 155.97,56.13 v156.23,56.39
  Bottom 0.254: LCD1.36 131.59,9.92 131.59,17.97 v132.03,18.41 | v161.69,21.4 161.69,25.15 162.58,26.04 162.58,30.48 160.86,32.19 v160.86,32.77 | v158,79.25 158,80.52 v153.88,84.64 151.46,87.06 131.46,87.06 128.79,84.39 v128.22,84.39 | 179.28,64.39 178.2,64.39 177.56,63.75 162.96,63.75 v162.58,63.63 | v179.28,64.77 179.28,64.39 | 179.28,64.39 189.69,64.39 191.21,62.87 191.21,57.59 v190.83,57.21 | v157.37,48.26 157.37,48.39 156.73,49.02 156.73,51.5 156.16,52.07 156.16,56.33 v156.23,56.39 156.92,55.69 v162.58,55.69
3V3TOUCH_CS  (via drill 0.6)
  Top 0.254: v144.8,26.54 144.73,26.48 142.32,26.48 140.54,28.26 140.54,31.62 134.89,37.27 134.89,38.92 133.35,40.46 IC7.8
  Bottom 0.254: LCD1.30 145.43,12.32 144.35,13.4 144.35,26.1 v144.8,26.54
3V3TOUCH_DIN  (via drill 0.6)
  Top 0.254: v142.76,27.5 142.13,27.5 141.11,28.51 141.11,31.88 135.46,37.53 135.46,39.18 133.52,41.12 IC7.9
  Bottom 0.254: v142.76,27.5 142.83,27.5 143.21,27.11 143.21,13.21 142.83,12.83 142.83,8.59 LCD1.31
3V3TOUCH_DO  (via drill 0.6)  (1 unrouted)
  Top 0.254: v148.61,62.87 155.4,62.87 157.12,64.58 157.12,65.66 | v137.49,21.08 138.57,22.16 146,22.16 147.72,23.88 147.72,27.62 148.86,28.77 148.86,29.78 146.96,31.69 v145.69,31.69
  Bottom 0.254: LCD1.33 137.81,8.57 137.75,8.64 137.75,10.6 137.88,10.73 137.88,20.7 v137.49,21.08 | v148.61,62.87 148.8,62.67 148.8,41.53 145.81,38.54 145.81,36.45 146.07,36.2 146.07,32.07 v145.69,31.69
3V3TOUCH_IRQ  (via drill 0.6)
  Top 0.254: v135.91,22.92 136.1,22.73 145.75,22.73 147.15,24.13 147.15,28 146.32,28.83 146.32,29.72 143.97,32.07 v143.97,32.51 | IC8.7 156.49,66.37 156.54,66.42 156.54,68.45 155.97,69.03 153.11,69.03 152.86,68.77 145.94,68.77 v144.67,69.15
  Bottom 0.254: v135.91,22.92 134.76,21.78 134.76,9.03 LCD1.34 | v144.67,69.15 144.67,61.02 143.91,60.26 143.91,53.78 142.51,52.39 142.51,46.29 144.29,44.51 144.29,32.83 v143.97,32.51
3V3TOUCH_SCLK  (via drill 0.6)
  Top 0.254: v146.19,26.23 145.56,25.59 142.38,25.59 139.97,28 139.97,31.43 134.32,37.08 134.32,38.67 133.16,39.83 IC7.7
  Bottom 0.254: LCD1.29 147.97,11.56 147.15,12.38 147.15,25.27 v146.19,26.23
!3V3ADC1_SELECT
  Top 0.254: IC9.6 126.95,80.26 128.54,78.68 128.54,76.33 129.99,74.88 IC4.8
!3V3ADC2_SELECT  (1 unrouted)
  Top 0.254: IC13.6 152.54,85.83 152.54,85.79 152.61,85.72 152.61,84.58 151.72,83.69 150.76,83.69 148.67,81.6 141.94,81.6 141.18,82.36 139.27,82.36 138.7,81.79 138.7,77.03 137.62,75.95 134.64,75.95 133.24,74.55 133.24,73.53 133.18,73.47 | IC4.3 133.19,73.48
!3V3BP_OE  (via drill 0.6)
  Top 0.254: IC2.10 151.97,51.56 v151.72,51.31 | v151.4,61.91 144.03,61.91 142.51,63.44 v138.45,63.44
  Top 0.305: IC1.21 103.72,39.64 103.97,39.88 103.97,49.97 v103.58,50.35
  Bottom 0.254: v103.58,50.35 111.84,58.61 118.76,58.61 123.59,63.44 v138.45,63.44 | v151.72,51.31 152.23,51.82 152.23,61.09 v151.4,61.91
!3V3CONVEND1  (via drill 0.6)  (2 unrouted)
  Top 0.254: v134.19,82.61 134.19,85.79 134.25,85.85 | 154.51,65.66 154.51,66.93 154.64,67.06 154.64,67.88 154.07,68.45 153.31,68.45 153.11,68.26 139.02,68.26 138.45,68.83 138.45,74.23 141.24,77.03 141.24,78.68 139.72,80.2 v139.72,81.47
  Bottom 0.254: v139.72,81.47 139.34,81.09 135.72,81.09 v134.19,82.61
!3V3CONVEND2  (via drill 0.6)
  Top 0.254: v159.59,83.63 IC12.6 | v158.64,75.5 159.15,75.5 161.05,73.6 161.05,67.69 v160.67,67.31 | IC8.3 153.88,67.31 v153.69,67.5
  Bottom 0.254: v159.59,83.63 159.02,83.06 159.02,75.88 v158.64,75.5 | v160.67,67.31 160.67,67.25 160.35,66.93 154.26,66.93 v153.69,67.5
!3V3DAC1_SELECT  (1 unrouted)
  Top 0.254: 124.41,85.92 124.41,79.63 126,78.04 126,76.71 126.38,76.33 127.71,76.33 129.33,74.71 IC4.9
!3V3DAC2_SELECT  (1 unrouted)
  Top 0.254: 150.07,85.85 150.13,85.92 | IC13.4 150.07,83.82 148.42,82.17 142.19,82.17 141.43,82.93 139.08,82.93 138.13,81.98 138.13,80.39 136.16,78.42 136.16,77.22 135.46,76.52 134.38,76.52 132.53,74.66 132.53,73.58 IC4.4
!3V3EEPROM_SELECT  (via drill 0.6)
  Top 0.254: IC15.1 v152.8,45.72 | IC2.6 151.51,54.18 v151.27,54.42
  Bottom 0.254: v152.8,45.72 150.76,47.75 150.76,51.69 151.27,52.2 v151.27,54.42
!3V3ETH_IRQ  (via drill 0.6)
  Top 0.254: v181.88,68.83 IC16.4 181.88,67.18 | IC8.6 155.83,67.83 v155.59,68.07
  Bottom 0.254: v181.88,68.83 180.36,68.83 179.85,69.34 159.66,69.34 158.38,68.07 v155.59,68.07
!3V3ETH_SELECT  (via drill 0.6)
  Top 0.254: IC16.9 178.63,65.46 178.32,65.15 178.32,63.5 v178.96,62.87 | IC2.7 150.84,53.52 150.19,54.17 v150.19,55.18
  Bottom 0.254: v178.96,62.87 178.39,62.87 178.13,62.61 163.72,62.61 163.21,62.1 156.35,62.1 155.59,62.87 151.02,62.87 150.13,61.98 150.13,57.47 150.7,56.9 150.7,55.69 v150.19,55.18
!3V3IO_EXPANDER1
  Top 0.254: IC9.3 123.14,84.52 123.59,84.07 123.59,77.03 124.86,75.75 127.46,75.75 128.67,74.55 IC4.10
!3V3IO_EXPANDER2
  Top 0.254: IC13.3 148.8,83.38 148.16,82.74 142.51,82.74 141.75,83.5 138.89,83.5 137.56,82.17 137.56,80.64 135.78,78.87 134.51,78.87 133.62,77.98 133.62,76.58 131.92,74.88 IC4.5
!3V3ISOLATOR1_EN  (via drill 0.6)
  Top 0.254: IC10.13 142.64,72.71 v142.64,70.04 | IC4.7 130.65,71.36 132.6,69.41 v133.62,69.41
  Bottom 0.254: v133.62,69.41 134.06,69.85 142.45,69.85 v142.64,70.04
!3V3ISOLATOR2_EN  (via drill 0.6)
  Top 0.254: IC10.10 144.57,71.48 v144.92,71.12 | v133.11,70.74 132.1,70.74 131.26,71.58 IC4.6
  Bottom 0.254: v144.92,71.12 142.38,71.12 141.69,70.42 133.43,70.42 v133.11,70.74
!3V3RESET  (via drill 0.6)
  Top 0.254: IC16.10 177.97,65.62 177.37,65.02 v177.37,64.9 | IC9.5 v125.68,84.45 | v151.34,84.64 IC13.5 | v155.97,79.06 156.48,78.55 156.48,77.22 157.24,76.45 159.02,76.45 161.62,73.85 161.62,65.72 v160.93,65.02 160.93,63.44 157.18,59.69 157.18,56.01 156.65,55.47 IC2.4
  Bottom 0.254: v125.68,84.45 126.64,83.5 128.67,83.5 131.65,86.49 149.62,86.49 151.34,84.77 v151.34,84.64 151.34,83.69 v155.97,79.06 | v177.37,64.9 177.31,64.9 176.74,64.33 163.15,64.33 162.89,64.58 161.37,64.58 v160.93,65.02
!3V3RTC_IRQ  (via drill 0.6)
  Top 0.254: IC14.5 192.46,60.35 190.9,61.91 v190.26,61.91 | v155.21,64.01 155.21,65.63 IC8.5
  Bottom 0.254: v190.26,61.91 190.26,62.99 189.44,63.82 178.45,63.82 177.82,63.18 163.47,63.18 162.96,62.67 156.54,62.67 v155.21,64.01
!ADC1_SELECT  (via drill 0.6)
  Top 0.254: v129.68,69.47 129.68,67.94 129.33,67.59 IC4.16
  Bottom 0.254: v129.68,69.47 129.68,70.48 134.7,75.5 137.81,75.5 MCU.15
!ADC2_SELECT  (via drill 0.6)
  Top 0.254: IC4.21 132.58,64.49 132.22,64.14 132.22,58.23 130.83,56.83 v130.83,56.07
  Bottom 0.254: v130.83,56.07 130.32,56.07 117.11,42.86 MCU.48
!BP_OUT1  (via drill 0.6)  (1 unrouted)
  Top 0.305: IC1.6 109.18,40.91 109.93,41.66 109.93,45.28 108.35,46.86 108.35,61.02 103.2,66.17 v101.3,66.17 | R1.1 79.07,99.83 v81.93,96.97
  Top 0.406: Q1.1 73.86,99.96 R1.1
  Bottom 0.305: v101.3,66.17 100.6,66.17 94.06,72.71 94.06,84.9 82.25,96.71
!BP_OUT2  (via drill 0.6)
  Top 0.305: IC1.7 105.31,41.52 104.54,42.29 104.54,58.55 103.08,60.01 v98.57,60.01 | v56.91,69.22 56.53,68.83 40.08,68.83 35.13,73.79 35.13,82.55 29.22,88.46 LED_O1-.A
  Bottom 0.305: v98.57,60.01 97.23,60.01 91.9,65.34 77.68,65.34 74.75,68.26 57.86,68.26 v56.91,69.22
!BP_OUT3  (via drill 0.6)
  Top 0.305: IC1.8 105.54,42.18 105.17,42.55 105.17,59.12 103.14,61.15 v99.84,61.15 | v57.8,70.42 56.78,70.42 55.9,69.53 41.16,69.53 36.21,74.49 36.21,82.8 26,93.02 LED_O1-.AG
  Bottom 0.305: v99.84,61.15 97.11,61.15 92.28,65.98 77.99,65.98 75.07,68.9 59.33,68.9 v57.8,70.42
!BP_OUT4  (via drill 0.6)
  Top 0.305: IC1.9 105.95,42.78 105.81,42.93 105.81,59.5 103.14,62.17 v98.5,62.17
  Bottom 0.305: v98.5,62.17 97.04,62.17 92.6,66.61 78.25,66.61 71.9,72.96 71.9,79.76 67.2,84.45 61.87,84.45 55.32,91 LED_S1-.K
!BP_OUT5  (via drill 0.6)
  Top 0.305: IC1.10 106.81,43.45 106.44,43.81 106.44,60.07 103.14,63.37 v97.42,63.37
  Bottom 0.305: v97.42,63.37 96.85,63.37 92.98,67.25 78.5,67.25 72.6,73.15 72.6,80.33 65.37,87.55 LED_S1+.K
!BP_OUT6  (via drill 0.6)  (1 unrouted)
  Top 0.305: IC1.11 109.16,44.05 109.3,44.2 109.3,45.02 107.71,46.61 107.71,60.77 103.33,65.15 100.73,65.15 100.22,65.66 v98.63,65.66
  Bottom 0.305: v98.63,65.66 98.44,65.66 92.66,71.44 92.66,81.34 85.55,88.46 83.2,88.46
!BP_OUT7  (via drill 0.6)
  Top 0.305: IC1.12 107.7,44.72 107.08,45.34 107.08,60.52 103.2,64.39 v99.81,64.39
  Bottom 0.305: v99.81,64.39 99.81,65.94 93.36,72.39 93.36,83.33 85.61,91.08 85.24,91.45 LED_O1+.AG
!BP_OUT8  (via drill 0.6)  (2 unrouted)
  Top 0.305: 102.71,44.72 IC1.13 93.22,44.72 92.6,45.34 91.08,45.34 v90.89,45.15 89.55,45.15 | 89.6,45.16 89.49,45.28 | Q4.1 R6.2 | R2.1 v90.63,50.87 v90.63,50.86
  Top 0.406: Q3.1 R2.1
  Bottom 0.305: v90.89,45.15 90.89,50.61 v90.63,50.86
!BP_OUT9  (via drill 0.6)
  Top 0.305: IC1.14 92.3,44.05 v91.96,44.39 | R4.1 91.14,37.4 v91.96,38.23
  Top 0.406: Q2.1 89.42,37.41 R4.1
  Bottom 0.305: v91.96,44.39 v91.96,38.23
!BP_OUT10  (via drill 0.6)
  Top 0.305: v90.89,43.43 102.55,43.43 IC1.15
  Bottom 0.305: LED_O2-.K 27.27,38.05 29.29,40.07 60.53,40.07 61.23,40.77 79.45,40.77 80.34,41.66 86.25,41.66 88.03,43.43 v90.89,43.43
!BP_OUT11  (via drill 0.6)
  Top 0.305: IC1.16 91.89,42.78 v89.93,40.83
  Bottom 0.305: LED_S2-.K 60.88,38 62.12,39.24 80.15,39.24 81.17,40.26 89.36,40.26 v89.93,40.83
!BP_OUT12  (via drill 0.6)
  Top 0.305: 102.55,42.16 IC1.17 92.8,42.18 90,39.37 83.39,39.37 v83.26,39.24
  Bottom 0.305: LED_S2+.K 79.93,38 81.17,39.24 v83.26,39.24
!BP_OUT13  (1 unrouted)
  Top 0.305: IC1.18 93.09,41.52 90.31,38.73 85.23,38.73 84.47,37.97
!BP_OUT14  (via drill 0.6)
  Top 0.305: v81.61,36.13 80.72,36.13 Q5.1 | IC1.19 96.42,40.91 v91.58,36.07
  Top 0.406: Q5.1 79.06,39.83 R7.1
  Bottom 0.305: v91.58,36.07 81.68,36.07 v81.61,36.13
!BP_OUT15  (via drill 0.6)
  Top 0.305: IC1.20 101.28,40.24 v100.92,39.88 | LED_PWR.K 104.76,99.73 101.87,96.84 101.87,84.58 v103.33,83.12
  Bottom 0.305: v100.92,39.88 101.17,40.13 101.17,63.94 103.33,66.1 v103.33,83.12
!CH1_ADC
  Top 0.305: IC9.11 126.95,93.92 130.44,97.41 130.44,99.57 X5.6
!CH1_DAC
  Top 0.305: IC9.13 124.41,93.92 127.91,97.41 127.91,99.57 X5.4
!CH1_EXPANDER
  Top 0.305: IC9.14 123.14,94.81 X5.3
!CH1_INT
  Top 0.305: IC11.3 134.19,96.33 132.99,97.54 132.99,99.57 X5.8
!CH1_RESET
  Top 0.305: IC9.12 125.68,94.3 129.18,97.79 X5.5
!CH2_ADC
  Top 0.305: IC13.11 152.61,94.3 155.84,97.54 155.84,99.57 X6.6
!CH2_DAC
  Top 0.305: IC13.13 150.07,94.3 153.31,97.54 153.31,99.57 X6.4
!CH2_EXPANDER
  Top 0.305: IC13.14 148.8,95.06 X6.3
!CH2_INT
  Top 0.305: IC12.3 159.59,96.33 158.38,97.54 158.38,99.57 X6.8
!CH2_RESET
  Top 0.305: IC13.12 151.34,94.74 154.57,97.98 X6.5
!CONVEND1  (via drill 0.6)
  Top 0.254: v141.11,81.09 141.11,80.26 142.45,78.93 143.72,78.93 146.7,75.95 150.89,75.95 152.03,74.8 154.64,74.8 155.2,74.24 IC8.20
  Bottom 0.254: v141.11,81.09 140.54,80.52 133.68,80.52 132.54,79.38 127.02,79.38 125.3,77.66 MCU.21
!CONVEND2  (via drill 0.6)
  Top 0.254: v143.59,76.45 145.37,76.45 146.45,75.37 150.64,75.37 151.78,74.23 154.19,74.23 154.54,73.89 IC8.21
  Bottom 0.254: v143.59,76.45 143.78,76.64 143.78,78.11 143.08,78.8 134.45,78.8 133.62,77.98 133.62,77.28 132.79,76.45 129.11,76.45 127.91,77.66 MCU.20
!DAC1_SELECT  (via drill 0.6)
  Top 0.254: IC4.15 128.67,68.39 v128.73,68.45
  Bottom 0.254: v128.73,68.45 128.73,70.48 134.32,76.07 135.84,76.07 MCU.16
!DAC2_SELECT  (via drill 0.6)  (1 unrouted)
  Top 0.254: v130.57,57.91 131.65,58.93 131.65,64.39 131.92,64.66 IC4.20
  Bottom 0.254: MCU.47 115.84,45.91 118.57,45.91 v130.57,57.91
!EEPROM_SELECT  (via drill 0.6)  (1 unrouted)
  Top 0.254: 114.57,42.16 115.78,43.37 119.08,43.37 v121.05,41.4 | IC2.18 159.64,53.52 159.4,53.28 159.4,51.69 155.59,47.88 149.56,47.88 147.72,49.72 134.64,49.72 v134.19,50.16
  Bottom 0.254: v121.05,41.4 121.05,41.97 128.73,49.66 133.68,49.66 v134.19,50.16
!ETH_IRQ  (via drill 0.6)
  Top 0.254: v143.97,80.64 145.81,78.8 150.64,78.8 151.4,78.04 151.4,77.09 152.54,75.95 155.21,75.95 156.49,74.66 IC8.18
  Bottom 0.254: v143.97,80.64 142.7,79.38 134.19,79.38 132.48,77.66 MCU.18
!ETH_SELECT  (via drill 0.6)
  Top 0.254: IC2.17 162.82,52.88 163.53,53.59 163.47,73.34 163.47,73.66 161.69,75.44 v161.69,78.74
  Bottom 0.254: MCU.11 176.16,77.66 175.02,78.8 171.85,78.8 171.28,79.38 162.32,79.38 v161.69,78.74
!IO_EXPANDER1  (via drill 0.6)
  Top 0.254: v127.71,69.47 127.71,68.14 128.03,67.82 IC4.14
  Bottom 0.254: v127.71,69.47 127.71,70.23 134.89,77.41 MCU.17
!IO_EXPANDER2  (via drill 0.6)
  Top 0.254: IC4.19 131.28,64.78 131.08,64.58 131.08,60.45 v130.7,60.07
  Bottom 0.254: v130.7,60.07 131.72,59.05 131.72,57.72 130.95,56.96 130.38,56.96 118.06,44.64 MCU.46
!ISOLATOR1_EN  (via drill 0.6)  (1 unrouted)
  Top 0.254: v130.7,68.26 130.7,68.14 129.99,67.42 IC4.17
  Bottom 0.254: 142.45,77.66 141.62,77.66 138.89,74.93 134.95,74.93 130.7,70.67 v130.7,68.26
!ISOLATOR2_EN  (via drill 0.6)  (1 unrouted)
  Top 0.254: IC4.18 130.62,64.95 130.51,64.83 130.51,62.74 v129.62,61.85
  Bottom 0.254: MCU.45 115.84,48.45 115.84,50.1 116.73,50.99 122.89,50.99 129.11,57.21 129.11,61.34 v129.62,61.85
!PWD_RST
  Bottom 0.254: JP1.1 MCU.A13
!RESET  (via drill 0.6)
  Top 0.254: MCU.RESET 178.07,30.16 176.99,31.24 167.34,31.24 166.45,32.13 166.45,46.55 v167.47,47.56 | IC2.20 161.93,54.81 162.39,54.36 v162.39,53.85
  Bottom 0.254: X3.2 195.79,13.78 195.28,14.29 185.88,14.29 183.75,16.42 SW1.3 SW1.4 181.21,26.2 178.07,29.34 MCU.RESET | v162.39,53.85 162.39,53.28 167.47,48.2 v167.47,47.56
!RTC_IRQ  (via drill 0.6)
  Top 0.254: v142.51,80.64 143.65,79.5 143.97,79.5 146.96,76.52 151.15,76.52 152.29,75.37 154.96,75.37 155.83,74.5 IC8.19
  Bottom 0.254: MCU.19 130.95,78.8 132.79,78.8 133.94,79.95 141.81,79.95 v142.51,80.64
+3V3  (via drill 0.6, 0.7)  (5 unrouted)
  Top 0.254: IC15.3 155.84,43.18 156.16,42.86 v156.16,40.77 | IC16.25 181.88,60.2 | C39.1 185.75,60.01 | IC16.15 175.38,60.1 | 183.82,60.01 184.04,60.01
  Top 0.305: IC15.7 IC15.8 | 154.07,58.9 C11.1 | IC16.15 175.38,58.64 175.59,58.42 177.94,58.42 | 177.94,58.42 178.39,58.42 178.63,58.66 IC16.20 178.63,61.14 178.83,61.34 181.63,61.34 181.88,61.09 181.88,60.2 | 181.88,60.01 IC16.25 181.88,58.61 182.07,58.42 183.59,58.42 183.78,58.61 183.78,59.97 IC16.28 183.82,60.01 | IC16.19 177.97,58.45 177.94,58.42 | IC9.1 120.6,86.42 119.84,87.19 119.17,87.19 C25.1 | 138.51,87.57 137.3,87.57 136.73,87 IC11.8 | IC12.8 162.13,86.86 162.45,87.19 163.38,87.19 C30.1 | C32.1 145.85,87.59 146.26,87.19 IC13.1 | 159.55,45.82 160.35,45.72 160.35,47.37 160.8,47.37 | C27.2 141.91,73.05 141.94,73.03 141.94,72.77 | C13.1 136.06,55.41 135.11,56.36 IC3.1 | 131.93,35.92 IC7.1 131.89,35.88 132.6,35.88 133.11,35.37 133.11,34.23 | v134.13,34.29 133.11,34.27 C20.1 | IC5.1 143.65,35.29 143.65,35.88 141.75,35.88 C17.1 | IC2.1 153.94,57.43 153.94,58.93 C11.1 | C11.1 154.13,58.93 | IC8.1 152.2,65.65 C22.1 | 136.49,73.03 134.51,73.03 134.51,73.47
  Top 0.356: IC1.24 102.95,37.7 102.44,37.72 102.57,37.59
  Top 0.406: C24.1 176.1,15.62 176.42,15.68 | R15.2 157.49,1.65 157.43,1.59 | R22.2 121.99,13.39 Q9.2 119.21,14.16 v111.58,14.16 | 159.55,45.82 IC15.8 | C36.1 160.8,47.37 162.19,47.37 162.26,47.31 | 151.08,67.09 C22.1 151.59,67.06 v151.84,67.31 | v120.79,88.01 119.18,88.01 C25.1 | v139.53,88.01 138.95,88.01 138.51,87.57 | v143.4,88.01 144,88.01 C32.1 | v162.45,88.01 163.34,88.01 163.78,87.57 C30.1 | D7.A v190.45,50.48 | 185.75,60.01 187.21,60.01 187.85,59.37 v187.85,53.28 | 184.04,60.01 185.54,60.01 C39.1 | C27.2 139.42,73.05 v139.4,73.03 | v137.49,73.03 136.49,73.03 C15.1 | C17.1 141.75,40.07 | C11.1 154.09,59.14 v155.27,60.13 155.21,60.2 144.86,60.2 139.53,54.86 C13.1
  Top 0.508: 102.57,37.59 102.57,35.81 102.82,35.56 | JP4.3 164.1,18.1 | L1.P$2 v168.8,98.55
  Top 0.61: C6.1 103.2,35.56 | 103.2,35.56 | 103.2,35.56 C6.1 | 103.2,35.56 104.6,35.56 105.55,34.61 105.55,33.34 107.46,31.43 v111.58,31.43 | v151.15,40.07 141.75,40.07 136.48,40.07 v136.41,40.01
  Top 0.813: v111.58,14.16 111.58,5.84 115.84,1.59 157.43,1.59 172.67,1.59 | v165.56,87.88 166.26,87.88 166.83,87.31 166.83,72.64
  Top 1.016: 164.1,24.26 162.26,26.1 v162.26,40.83 162.26,47.31 v166.83,51.88 v166.83,55.05 v166.83,60.39 166.83,72.64 v166.83,72.77 166.83,72.9
  Top 1.27: 176.42,15.68 176.42,11.49 176.36,11.43 | 171.09,12.19 171.02,12.26 165.81,12.26 164.1,13.97 164.1,18.1 JP2.1 164.1,24.26
  Bottom 0.406: v143.4,88.01 143.21,88.01 | v190.45,50.48 168.16,50.48 166.83,51.82 v166.83,51.88 | 150.89,72.77 151.08,72.58 151.08,68.07 v151.84,67.31 | v136.41,40.01 136.35,40.01 134.13,38.23 v134.13,34.29
  Bottom 0.508: v165.56,87.88 165.43,88.01 166.45,88.01 166.77,88.33 166.77,96.52 v168.8,98.55
  Bottom 0.61: v111.58,31.43 v111.58,14.16 | v187.85,53.28 177.05,53.28 175.28,55.05 v166.83,55.05 | 150.89,72.77 150.7,72.71 150.45,72.96 139.46,72.96 v139.4,73.03 v137.49,73.03 | v166.83,60.39 155.53,60.39 v155.27,60.13 | v162.26,40.83 162.13,40.83 162.07,40.77 v156.16,40.77 153.05,40.77 152.35,40.07 v151.15,40.07
  Bottom 0.813: v120.79,88.01 v139.53,88.01 143.21,88.01 | v143.4,88.01 v162.45,88.01 165.18,88.01 v165.56,87.88 | v166.83,72.77 150.89,72.77
  other vias: 186.13,5.65 186.13,7.11 186.13,8.57 186.13,10.03 177.75,5.65 177.75,7.11 177.75,8.57 177.75,10.03 177.75,11.49 186.13,11.49
  pour Top (isolate 0.406, no thermals): 200.29,14.29 170.77,14.29 170.77,-0.32 200.29,-0.32
  pour Bottom (isolate 0.406, no thermals): 200.29,14.29 170.77,14.29 170.77,-0.32 200.29,-0.32
+5V  (via drill 0.6, 0.7)  (6 unrouted)
  Top 0.254: 168.04,85.47 167.97,85.41 | SG1.+ SG1.+B
  Top 0.305: 184.49,18.55 184.48,18.55
  Top 0.406: C35.2 167.02,90.74 166.96,90.68 | 169.88,85.53 169.18,85.53 169.18,88.14 168.16,89.15 168.16,90.3 C35.2 | LED_PWR.A 106,103.44 106.06,103.44 | C19.1 184.36,18.55 | 100.16,103.44 100.16,84.71 102.86,82 LED_CV1.A | D2.C 44.77,37.01 LED_S2-.A | Q2.2 87.53,36.38 | 87.53,36.38 87.54,37.39 R4.2 | R7.2 77.18,39.8 Q5.2 v76.09,36.7 | 89.03,52.75 91.35,52.75 91.96,52.13 91.96,47.62 | Q3.2 89.03,52.75 | 89.03,52.75 R2.2 | LED_O2+.A 81.88,37.9 83.26,36.51 87.41,36.51 87.53,36.38
  Top 0.61: Q1.2 73.88,101.84 R1.2 88.41,101.72 88.41,101.73 | 88.41,101.73 88.34,101.73 | 88.41,101.73 88.41,96.26 LED_O1+.C | v102.31,47.62 91.96,47.62 86.19,47.62 81.93,43.37 C2.1 81.93,38.05 LED_O2+.A | 168.61,18.48 168.66,18.43 JP4.1 168.66,23.35 JP2.3
  Top 0.813: 106.06,103.44 166.07,103.44 166.96,102.55 166.96,90.68 166.96,88.77 167.97,87.76 167.97,85.41 167.97,76.77 168.54,76.2 170.01,76.2 170.7,75.5 v170.7,72.01 | 106,103.44 100.16,103.44 90.06,103.44 88.41,101.79 88.41,101.73
  Top 1.27: 184.48,18.55 184.36,18.55 179.78,18.55 179.66,18.43 | IC6.3 179.66,18.43 | X4.1 191.34,16.89 189.63,18.61 | 189.63,18.61 D6.C | 184.49,18.55 189.57,18.55 189.63,18.61 | MCU.5V 172.99,23.94 173.05,23.88 | JP2.3 173.05,23.88 | 173.05,23.88 174.21,23.88 179.66,18.43
  Bottom 0.406: LED_S1-.A 43.78,92.15 43.83,92.39 | LED_S1+.A 62.83,92.15 62.88,92.39 | LED_CC1.A LED_CV1.A | LED_CV2.A LED_CC2.A 104.73,17.9 105.55,17.08 109.05,17.08 109.36,17.4 | LED_O2-.A 24.73,37.9 26.62,36.01 43.77,36.01 | LED_S2+.A 62.83,36.14 62.69,36.01 | v76.09,36.7 76.09,36.07 76.03,36.01
  Bottom 0.61: 83.14,91 81.74,92.39 62.88,92.39 43.83,92.39 40.85,92.39 40.08,93.15 28.15,93.15 25.99,91 | LED_S2-.A 43.77,37.99 43.77,36.01 62.69,36.01 76.03,36.01 79.83,36.01 81.87,38.04 | v102.31,47.62 103.14,47.62 109.36,41.4 109.36,17.4 109.36,8.06 115.14,2.29 169.31,2.29 170.77,3.75 170.77,14.03 169.18,15.62 JP2.3
  Bottom 1.016: 195.85,16.89 194.45,16.89 192.74,18.61 192.74,30.54 197.82,35.62 197.82,64.64 190.45,72.01 v170.7,72.01
+5V_CH1  (via drill 0.6)
  Top 0.305: IC17.1 95.6,74.24 v95.9,74.55 | 98.63,74.11 98.63,72.26 98.38,72.01 97.5,72.01 IC17.4 | 98.25,76.01 98.19,76.07 IC18.8 98.69,76.07 98.63,76.01 98.63,74.11 | 98.63,74.11 C45.1 99.81,75.02 v99.71,75.12 | IC18.4 101.11,79.88 v99.58,81.41
  Bottom 0.305: v99.71,75.12 96.47,75.12 v95.9,74.55
  Bottom 0.406: v99.71,75.12 99.58,75.25 v99.58,81.41 99.58,87.63 103.71,91.76 X9.1
+5V_CH2  (via drill 0.6)  (1 unrouted)
  Top 0.305: IC19.1 94.08,20.03 v94.12,20.07 94.19,20.13 | IC20.8 95.57,15.18 v94.12,15.18 93.11,15.18 92.79,15.49 92.79,16.69 IC19.4 | IC20.4 99.39,11.81 100.22,12.64 104.28,12.64 X11.1
  Top 0.406: v94.12,15.18 94.12,14.03 93.55,13.46 | X11.1 104.35,15.49 99.78,20.07 v94.12,20.07
  Bottom 0.305: v94.12,20.07 v94.12,15.18
BP_OE  (via drill 0.6)
  Top 0.254: IC2.14 163.27,50.93 165.24,52.9 165.24,74.99 v165.05,75.18
  Bottom 0.254: MCU.10 173.88,77.66 172.55,76.33 166.83,76.33 165.69,75.18 v165.05,75.18
BP_SELECT  (via drill 0.6)
  Top 0.254: IC2.15 163.15,51.56 164.67,53.09 164.67,74.17 164.1,74.74 v164.1,78.61
  Bottom 0.254: MCU.9 171.97,77.85 171.02,78.8 164.29,78.8 v164.1,78.61
BUZZER  (1 unrouted)
  Top 0.254: Q8.1 182.64,74.99 R13.2 | R13.2 179.72,77.66 MCU.12
CH1_5VDC  (via drill 0.6)
  Top 0.406: C26.1 120.3,90.97 IC9.16 120.6,98.17 123.08,100.65 123.9,100.65 X5.2 | C29.1 136.73,90.97 IC11.1 v136.73,93.21 v136.73,93.22
  Bottom 0.406: v136.73,93.22 126.13,93.22 122.13,97.22 122.13,99.69 123.27,100.84 X5.2
CH1_GND
  pour Top (isolate 0.305): 139.97,102.23 139.97,89.85 118.06,89.85 118.06,102.23
  pour Bottom (isolate 0.305): 139.97,102.23 139.97,89.85 118.06,89.85 118.06,102.23
CH1_MISO
  Top 0.305: IC11.2 135.46,97.1 X5.9
CH1_MOSI
  Top 0.305: IC9.15 121.87,96.08 X5.1
CH1_SCLK
  Top 0.305: IC9.10 128.22,94.23 131.72,97.73 X5.7
CH2_5VDC  (via drill 0.6)
  Top 0.406: C33.1 146.26,90.97 IC13.16 146.26,98.49 148.61,100.84 X6.2 | C31.1 162.13,90.97 IC12.1 v162.13,93.21 v162.13,93.22
  Bottom 0.406: v162.13,93.22 151.27,93.22 147.72,96.77 147.72,99.95 148.61,100.84 X6.2
CH2_GND
  pour Top: 143.46,102.23 165.37,102.23 165.37,89.85 143.46,89.85
  pour Bottom: 143.46,102.23 165.37,102.23 165.37,89.85 143.46,89.85
CH2_MISO
  Top 0.305: IC12.2 160.86,97.1 X6.9
CH2_MOSI
  Top 0.305: IC13.15 147.53,96.33 X6.1
CH2_SCLK
  Top 0.305: IC13.10 153.88,94.74 157.12,97.98 X6.7
EARTH  (via drill 0.6)  (2 unrouted)
  Top 0.305: C41.2 175.08,102.11 v175.02,102.17 | v185.18,84.01 C40.2
  Top 0.406: v84.09,100.39 C1.2
  Top 0.61: C5.1 19.12,93.85 SAR1.P$1
  Top 0.813: C7.2 64.79,3.49 63.2,1.91 31.58,1.91 23.45,10.03 23.45,12.64 | C10.1 12.21,12.21 J7.P$1
  Bottom 0.305: v175.02,102.17 175.02,103.69 | X8.4 183.53,91.95 184.8,93.22 X8.5 | X8.SH1 186,84.83 v185.18,84.01
  Bottom 0.406: 176.36,103.63 176.42,103.69
  Bottom 0.61: v84.09,100.39 84.09,103.57 | 84.09,103.57 84.15,103.63 | 84.09,103.57 84.09,103.69 | X8.SH1 188.8,93.22 | 188.8,93.22 X8.SH2 | X8.5 188.8,93.22
  Bottom 0.813: X8.SH2 185.44,103.69 176.42,103.69 175.02,103.69 84.09,103.69 21.6,103.69 SAR1.P$1
  Bottom 3.048: SAR2.P$1 20.69,10 J7.P$1 9.89,10 6.37,13.53 6.37,91.63 12.27,97.53 SAR1.P$1
ETH_IN+  (via drill 0.6)  (1 unrouted)
  Top 0.254: R19.1 179.46,99.76 | 176.04,67.28 176.04,69.72 176.48,70.17 176.48,76.33 175.78,77.03 175.78,78.04 177.75,80.01 v177.75,83.88
  Top 0.305: 176.04,67.28 IC16.13 | R19.1 | X8.8 181.12,97.03 180.48,97.66 180.48,99.31 180.04,99.76 179.09,99.76
  Bottom 0.254: X8.8 182.32,96.39 180.8,96.39 178.64,94.23 178.64,84.77 v177.75,83.88
ETH_IN-  (via drill 0.6)
  Top 0.254: IC16.12 176.67,69.53 177.05,69.91 177.05,75.75 178.32,77.03 178.32,82.93 v179.21,83.82
  Top 0.305: R18.2 X8.7
  Bottom 0.254: X8.7 180.99,95.76 179.21,93.98 v179.21,83.82
ETH_LEDA  (1 unrouted)